# Altium schematic sheet Sheet2.SchDoc
size A
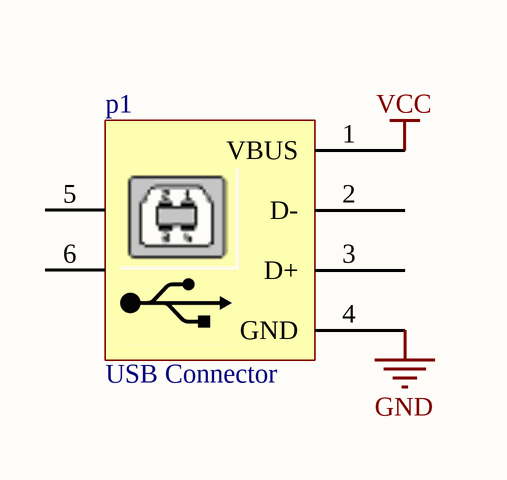
[diagram p0: Sheet2.SchDoc]

## Parts
p1  USB Connector  [USB2.5-2H4E]

## Nets
GND: p1.4(GND)
VCC: p1.1(VBUS)

Not connected (* = marked no-connect by the designer): p1 2(D-) 3(D+) 5 6

## Library data of the parts
p1 = USB: USB Connector-B Type; Designer: Eng. Saeid Jorablo; Company: DASE Co; Adding Date: 10/26/2010